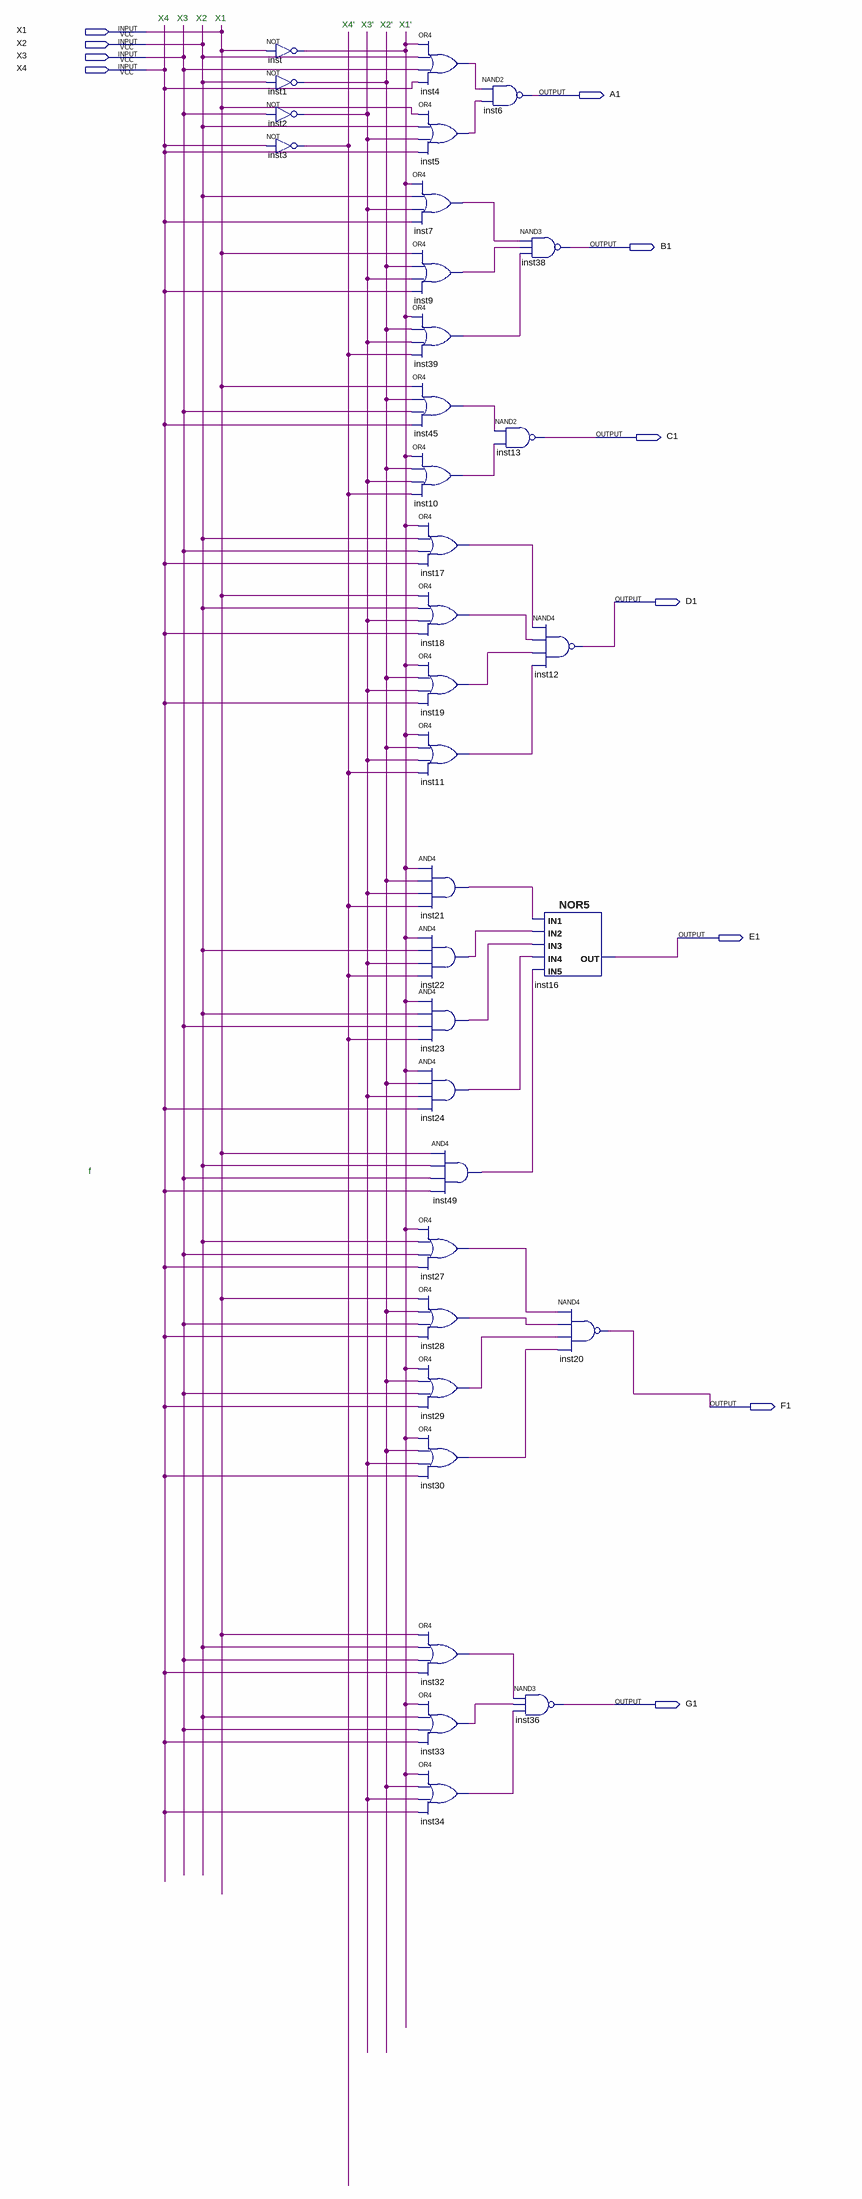
[diagram p0: schematic sheet]
// Quartus schematic Indicator1.bdf as structural Verilog: 34 symbols, 11 pins
module Indicator1 (
  input  X1,
  input  X2,
  input  X3,
  input  X4,
  output A1,
  output B1,
  output C1,
  output D1,
  output E1,
  output F1,
  output G1
);

  wire inst1_out, inst2_out, inst3_out, inst4_out, inst5_out, inst7_out, inst9_out, inst10_out, inst11_out,
       inst17_out, inst18_out, inst19_out, inst21_out, inst22_out, inst23_out, inst24_out, inst27_out,
       inst28_out, inst29_out, inst30_out, inst32_out, inst33_out, inst34_out, inst39_out, inst45_out,
       inst49_out, inst_out;

  not inst (inst_out, X1);
  not inst1 (inst1_out, X2);
  not inst2 (inst2_out, X3);
  not inst3 (inst3_out, X4);
  or inst4 (inst4_out, inst_out, X2, X3, X4);
  or inst5 (inst5_out, X1, X2, inst2_out, X4);
  or inst7 (inst7_out, inst_out, X2, inst2_out, X4);
  or inst9 (inst9_out, X1, inst1_out, inst2_out, X4);
  or inst39 (inst39_out, inst_out, inst1_out, inst2_out, inst3_out);
  or inst45 (inst45_out, X1, inst1_out, X3, X4);
  or inst10 (inst10_out, inst_out, inst1_out, inst2_out, inst3_out);
  or inst17 (inst17_out, inst_out, X2, X3, X4);
  or inst18 (inst18_out, X1, X2, inst2_out, X4);
  or inst19 (inst19_out, inst_out, inst1_out, inst2_out, X4);
  or inst11 (inst11_out, inst_out, inst1_out, inst2_out, inst3_out);
  and inst21 (inst21_out, inst_out, inst1_out, inst2_out, inst3_out);
  and inst22 (inst22_out, inst_out, X2, inst2_out, inst3_out);
  and inst23 (inst23_out, inst_out, X2, X3, inst3_out);
  and inst24 (inst24_out, inst_out, inst1_out, inst2_out, X4);
  and inst49 (inst49_out, X1, X2, X3, X4);
  or inst27 (inst27_out, inst_out, X2, X3, X4);
  or inst28 (inst28_out, X1, inst1_out, X3, X4);
  or inst29 (inst29_out, inst_out, inst1_out, X3, X4);
  or inst30 (inst30_out, inst_out, inst1_out, inst2_out, X4);
  or inst32 (inst32_out, X1, X2, X3, X4);
  or inst33 (inst33_out, inst_out, X2, X3, X4);
  or inst34 (inst34_out, inst_out, inst1_out, inst2_out, X4);
  nand inst6 (A1, inst4_out, inst5_out);
  nand inst38 (B1, inst7_out, inst9_out, inst39_out);
  nand inst13 (C1, inst45_out, inst10_out);
  nand inst12 (D1, inst17_out, inst18_out, inst19_out, inst11_out);
  nor inst16 (E1, inst21_out, inst22_out, inst23_out, inst24_out, inst49_out);
  nand inst36 (G1, inst32_out, inst33_out, inst34_out);
  nand inst20 (F1, inst27_out, inst28_out, inst29_out, inst30_out);

  // Notes on the sheet:
  //   X4
  //   X3
  //   X2
  //   X1
  //   X4'
  //   X3'
  //   X2'
  //   X1'
  //   f
endmodule
